# Altium schematic sheet GE910QUAD Modem.SchDoc: GE910 GSM Modem & SIM
size 393 x 281 mm; DocumentNumber: 9; SheetNumber: 9; SheetTotal: 54
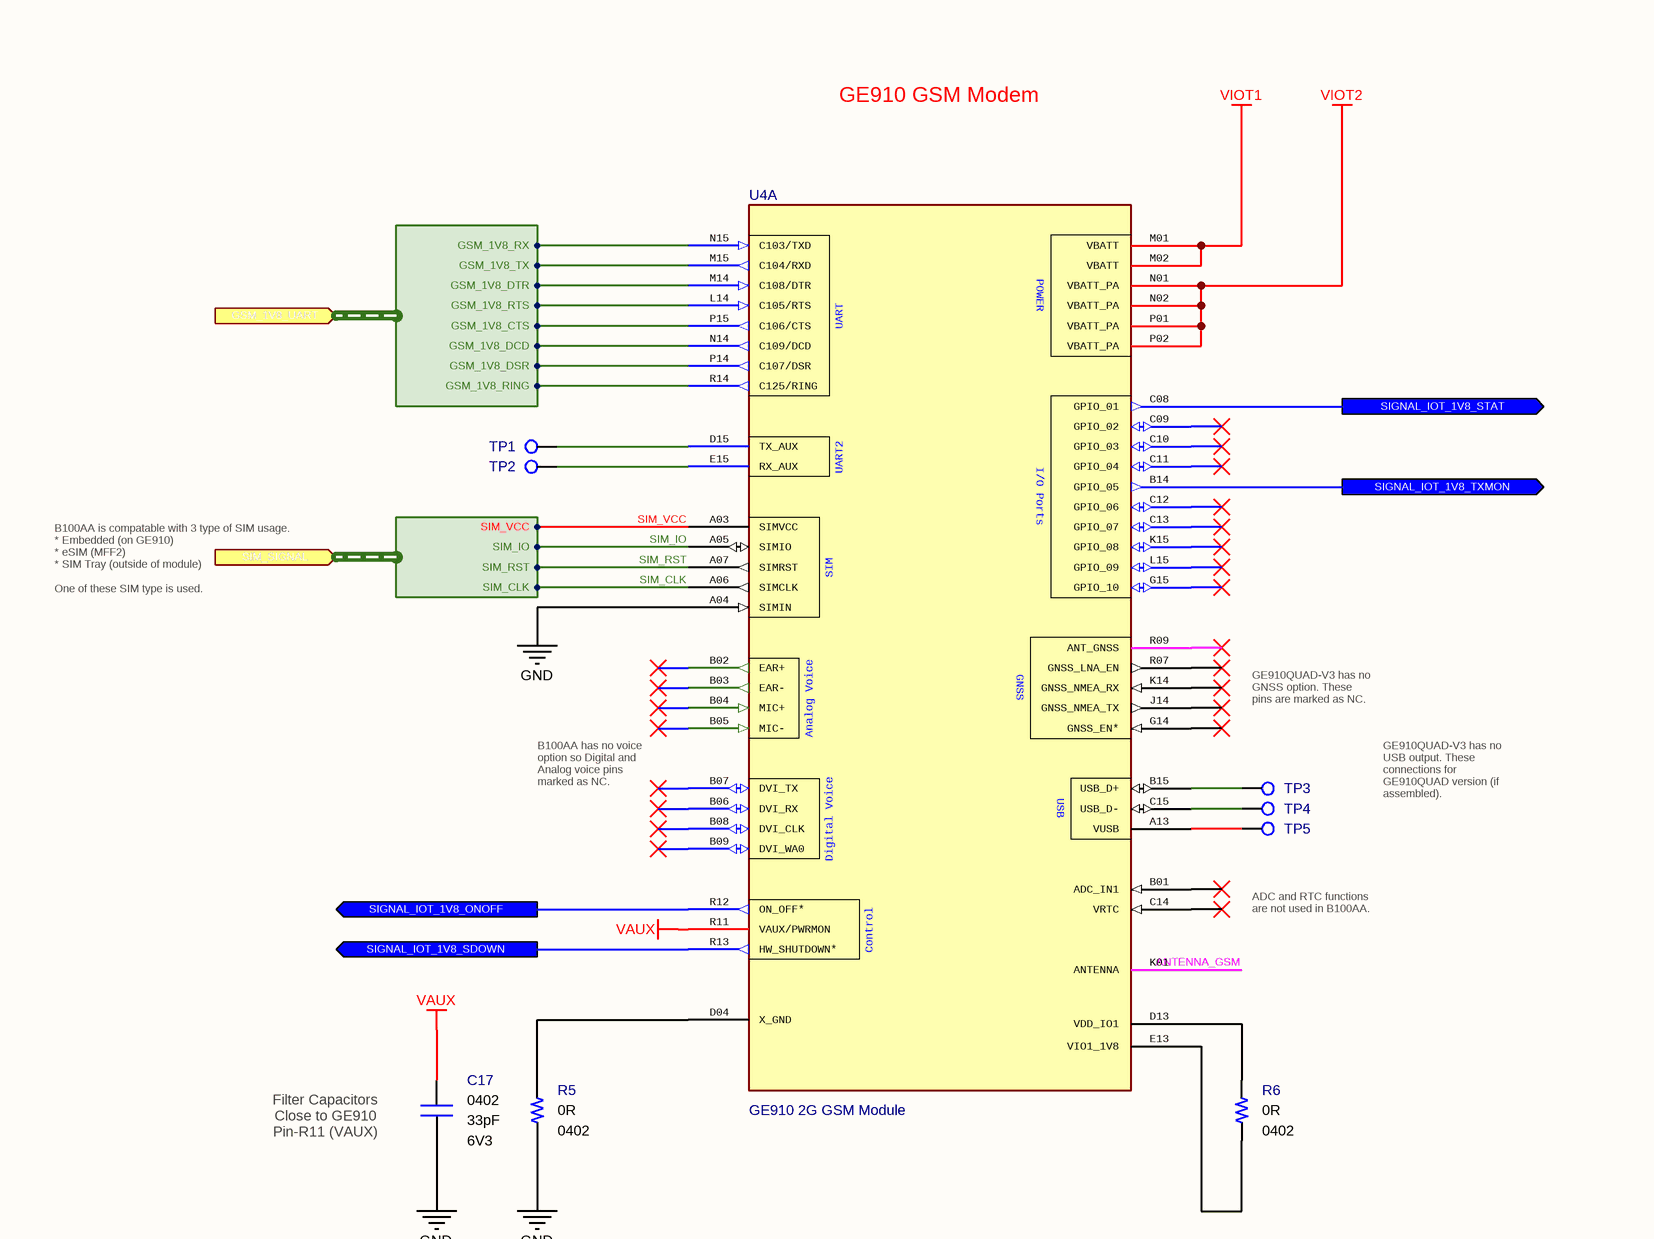
[diagram p0: GE910QUAD Modem.SchDoc, top left]
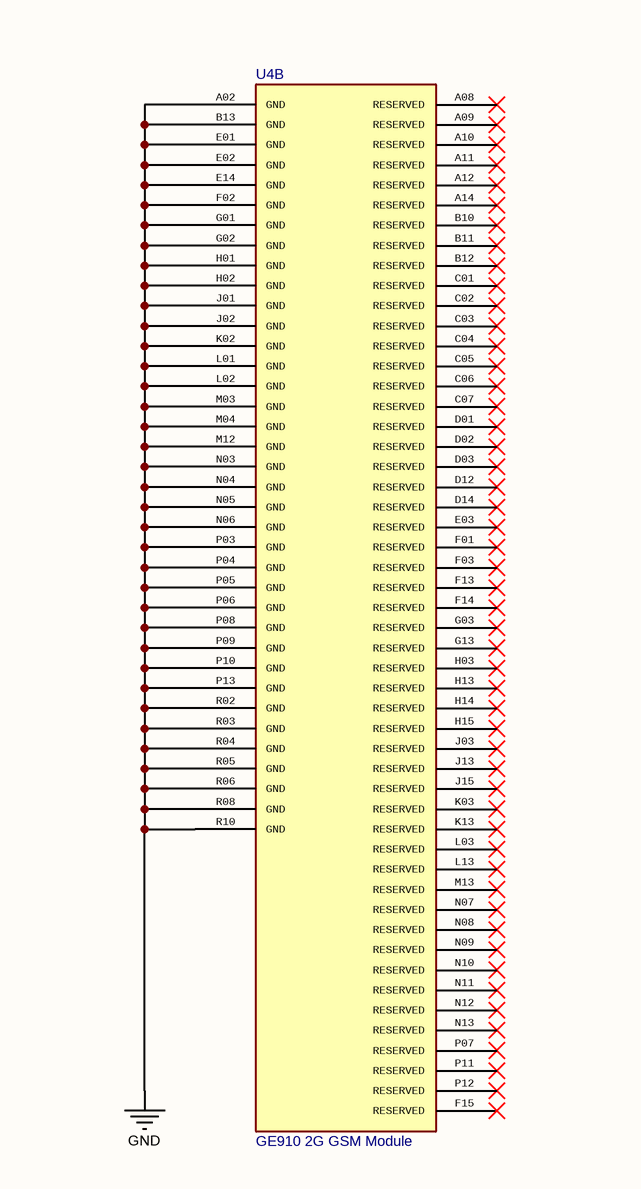
[diagram p1: GE910QUAD Modem.SchDoc, top right]
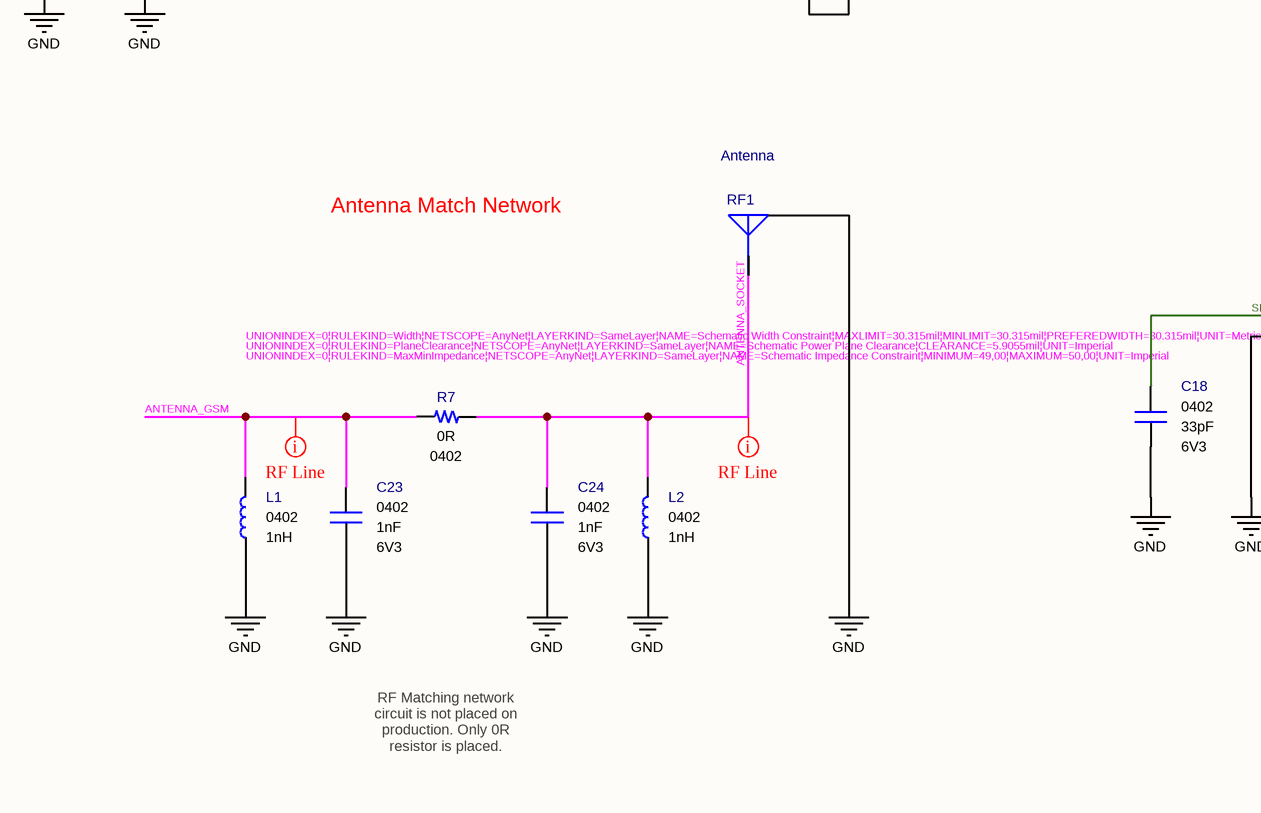
[diagram p2: GE910QUAD Modem.SchDoc, bottom left]
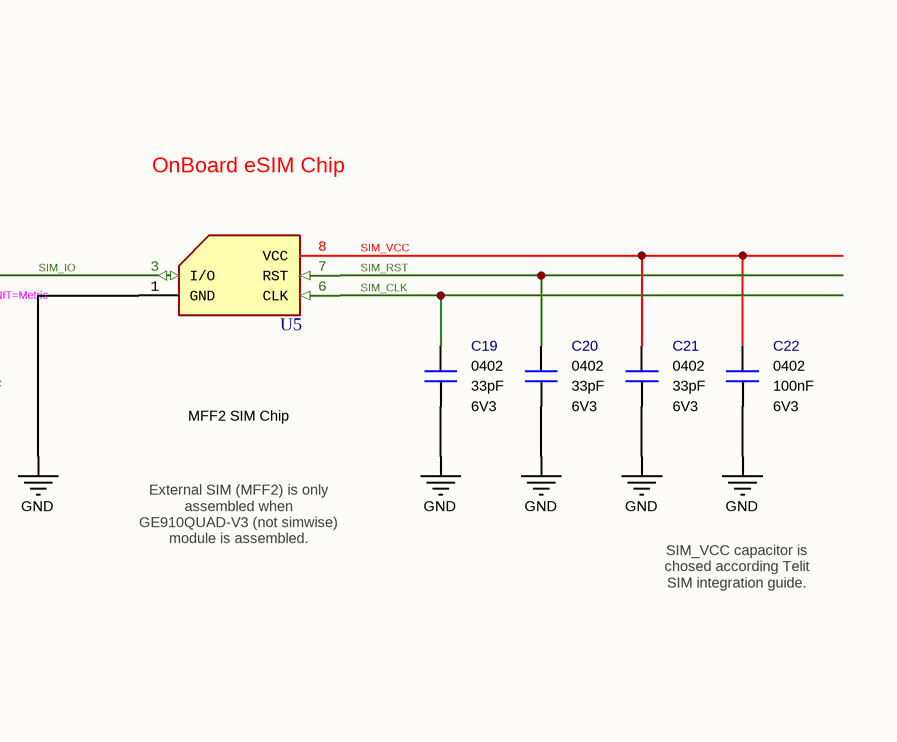
[diagram p3: GE910QUAD Modem.SchDoc, bottom right]

## Parts
C17  value 33pF  Case: 0402  Voltage: 6V3  [CAPACITOR_0402]  (hidden comment: Multilayer Ceramic Capacitor)
C18  value 33pF  Case: 0402  Voltage: 6V3  [CAPACITOR_0402]  (hidden comment: Multilayer Ceramic Capacitor)
C19  value 33pF  Case: 0402  Voltage: 6V3  [CAPACITOR_0402]  (hidden comment: Multilayer Ceramic Capacitor)
C20  value 33pF  Case: 0402  Voltage: 6V3  [CAPACITOR_0402]  (hidden comment: Multilayer Ceramic Capacitor)
C21  value 33pF  Case: 0402  Voltage: 6V3  [CAPACITOR_0402]  (hidden comment: Multilayer Ceramic Capacitor)
C22  value 100nF  Case: 0402  Voltage: 6V3  [CAPACITOR_0402]  (hidden comment: Multilayer Ceramic Capacitor)
C23  value 1nF  Case: 0402  Voltage: 6V3  [CAPACITOR_0402]  (hidden comment: Multilayer Ceramic Capacitor)
C24  value 1nF  Case: 0402  Voltage: 6V3  [CAPACITOR_0402]  (hidden comment: Multilayer Ceramic Capacitor)
L1  value 1nH  Case: 0402  [INDUCTOR_0402]  (hidden comment: Fixed Inductor)
L2  value 1nH  Case: 0402  [INDUCTOR_0402]  (hidden comment: Fixed Inductor)
R5  value 0R  Case: 0402  [RESISTOR_0402]  (hidden comment: Thick Film Resistor)
R6  value 0R  Case: 0402  [RESISTOR_0402]  (hidden comment: Thick Film Resistor)
R7  value 0R  Case: 0402  [RESISTOR_0402]  (hidden comment: Thick Film Resistor)
RF1  Antenna  [Connector_IPEX]
TP1  PCB - Test Point  [Test_Point]  (value not drawn)  (no BOM)
TP2  PCB - Test Point  [Test_Point]  (value not drawn)  (no BOM)
TP3  PCB - Test Point  [Test_Point]  (value not drawn)  (no BOM)
TP4  PCB - Test Point  [Test_Point]  (value not drawn)  (no BOM)
TP5  PCB - Test Point  [Test_Point]  (value not drawn)  (no BOM)
U4  GE910 2G GSM Module  [GE910 2G GSM Modem]  (parts A,B of 2)
U5  MFF2 SIM Chip  [MFF2]

## Ports
GSM_1V8_UART (in, harness GSM_1V8_UART), SIGNAL_IOT_1V8_ONOFF (out), SIGNAL_IOT_1V8_SDOWN (out), SIGNAL_IOT_1V8_STAT (out), SIGNAL_IOT_1V8_TXMON (out), SIM_SIGNAL (in, harness SIM_SIGNAL)

## Harnesses
GSM_1V8_UART: GSM_1V8_RX, GSM_1V8_TX, GSM_1V8_DTR, GSM_1V8_RTS, GSM_1V8_CTS, GSM_1V8_DCD, GSM_1V8_DSR, GSM_1V8_RING
SIM_SIGNAL: SIM_VCC, SIM_IO, SIM_RST, SIM_CLK

## Nets
GND: C17.1 C18.1 C19.1 C20.1 C21.1 C22.1 C23.1 C24.1 L1.1 L2.1 R5.1 RF1.2(GND) U4.A02(GND) U4.A04(SIMIN) U4.B13(GND) U4.E01(GND) U4.E02(GND) U4.E14(GND) U4.F02(GND) U4.G01(GND) U4.G02(GND) U4.H01(GND) U4.H02(GND) U4.J01(GND) U4.J02(GND) U4.K02(GND) U4.L01(GND) U4.L02(GND) U4.M03(GND) U4.M04(GND) U4.M12(GND) U4.N03(GND) U4.N04(GND) U4.N05(GND) U4.N06(GND) U4.P03(GND) U4.P04(GND) U4.P05(GND) U4.P06(GND) U4.P08(GND) U4.P09(GND) U4.P10(GND) U4.P13(GND) U4.R02(GND) U4.R03(GND) U4.R04(GND) U4.R05(GND) U4.R06(GND) U4.R08(GND) U4.R10(GND) U5.1(GND)
VAUX: C17.2 U4.R11(VAUX/PWRMON)
VIOT1: U4.M01(VBATT) U4.M02(VBATT)
VIOT2: U4.N01(VBATT_PA) U4.N02(VBATT_PA) U4.P01(VBATT_PA) U4.P02(VBATT_PA)
ANTENNA_GSM: C23.2 L1.2 R7.2 U4.K01(ANTENNA)
ANTENNA_SOCKET: C24.2 L2.2 R7.1 RF1.1(Signal)
SIGNAL_IOT_1V8_ONOFF: U4.R12(ON_OFF*) ; port SIGNAL_IOT_1V8_ONOFF
SIGNAL_IOT_1V8_SDOWN: U4.R13(HW_SHUTDOWN*) ; port SIGNAL_IOT_1V8_SDOWN
SIGNAL_IOT_1V8_STAT: U4.C08(GPIO_01) ; port SIGNAL_IOT_1V8_STAT
SIGNAL_IOT_1V8_TXMON: U4.B14(GPIO_05) ; port SIGNAL_IOT_1V8_TXMON
SIM_CLK: C19.2 U4.A06(SIMCLK) U5.6(CLK) ; port SIM_SIGNAL.SIM_CLK
SIM_IO: C18.2 U4.A05(SIMIO) U5.3(I/O) ; port SIM_SIGNAL.SIM_IO
SIM_RST: C20.2 U4.A07(SIMRST) U5.7(RST) ; port SIM_SIGNAL.SIM_RST
SIM_VCC: C21.2 C22.2 U4.A03(SIMVCC) U5.8(VCC) ; port SIM_SIGNAL.SIM_VCC
NetR5_2: R5.2 U4.D04(X_GND)
NetR6_1: R6.1 U4.E13(VIO1_1V8)
NetR6_2: R6.2 U4.D13(VDD_IO1)
NetTP1_1: TP1.1 U4.D15(TX_AUX)
NetTP2_1: TP2.1 U4.E15(RX_AUX)
NetTP3_1: TP3.1 U4.B15(USB_D+)
NetTP4_1: TP4.1 U4.C15(USB_D-)
NetTP5_1: TP5.1 U4.A13(VUSB)
NetU4_L14: U4.L14(C105/RTS) ; port GSM_1V8_UART.GSM_1V8_RTS
NetU4_M14: U4.M14(C108/DTR) ; port GSM_1V8_UART.GSM_1V8_DTR
NetU4_M15: U4.M15(C104/RXD) ; port GSM_1V8_UART.GSM_1V8_TX
NetU4_N14: U4.N14(C109/DCD) ; port GSM_1V8_UART.GSM_1V8_DCD
NetU4_N15: U4.N15(C103/TXD) ; port GSM_1V8_UART.GSM_1V8_RX
NetU4_P14: U4.P14(C107/DSR) ; port GSM_1V8_UART.GSM_1V8_DSR
NetU4_P15: U4.P15(C106/CTS) ; port GSM_1V8_UART.GSM_1V8_CTS
NetU4_R14: U4.R14(C125/RING) ; port GSM_1V8_UART.GSM_1V8_RING

Not connected (* = marked no-connect by the designer): U4 A08(RESERVED)* A09(RESERVED)* A10(RESERVED)* A11(RESERVED)* A12(RESERVED)* A14(RESERVED)* B01(ADC_IN1)* B02(EAR+)* B03(EAR-)* B04(MIC+)* B05(MIC-)* B06(DVI_RX)* B07(DVI_TX)* B08(DVI_CLK)* B09(DVI_WA0)* B10(RESERVED)* B11(RESERVED)* B12(RESERVED)* C01(RESERVED)* C02(RESERVED)* C03(RESERVED)* C04(RESERVED)* C05(RESERVED)* C06(RESERVED)* C07(RESERVED)* C09(GPIO_02)* C10(GPIO_03)* C11(GPIO_04)* C12(GPIO_06)* C13(GPIO_07)* C14(VRTC)* D01(RESERVED)* D02(RESERVED)* D03(RESERVED)* D12(RESERVED)* D14(RESERVED)* E03(RESERVED)* F01(RESERVED)* F03(RESERVED)* F13(RESERVED)* F14(RESERVED)* F15(RESERVED)* G03(RESERVED)* G13(RESERVED)* G14(GNSS_EN*)* G15(GPIO_10)* H03(RESERVED)* H13(RESERVED)* H14(RESERVED)* H15(RESERVED)* J03(RESERVED)* J13(RESERVED)* J14(GNSS_NMEA_TX)* J15(RESERVED)* K03(RESERVED)* K13(RESERVED)* K14(GNSS_NMEA_RX)* K15(GPIO_08)* L03(RESERVED)* L13(RESERVED)* L15(GPIO_09)* M13(RESERVED)* N07(RESERVED)* N08(RESERVED)* N09(RESERVED)* N10(RESERVED)* N11(RESERVED)* N12(RESERVED)* N13(RESERVED)* P07(RESERVED)* P11(RESERVED)* P12(RESERVED)* R07(GNSS_LNA_EN)* R09(ANT_GNSS)*; U5 2(NC) 4(NC) 5(NC)

## Layout directives
rule Impedance Constraint [Min = 49.00    Max = 50.00    ]; rule Power Plane Clearance [Clearance = 5.906mil]; rule Width Constraint [Pref Width = 0.77mm    Min Width = 0.77mm    Max Width = 0.77mm]: ANTENNA_GSM, ANTENNA_SOCKET

## Notes on the sheet
- GE910 GSM Modem
- B100AA is compatable with 3 type of SIM usage.
  * Embedded (on GE910)
  * eSIM (MFF2)
  * SIM Tray (outside of module)
  One of these SIM type is used.
- GE910QUAD-V3 has no GNSS option. These pins are marked as NC.
- B100AA has no voice option so Digital and Analog voice pins marked as NC.
- GE910QUAD-V3 has no USB output. These connections for GE910QUAD version (if assembled).
- ADC and RTC functions are not used in B100AA.
- (near C17) Filter Capacitors
  Close to GE910
  Pin-R11 (VAUX)
- Antenna Match Network
- (near U5) OnBoard eSIM Chip
- External SIM (MFF2) is only assembled when GE910QUAD-V3 (not simwise) module is assembled.
- SIM_VCC capacitor is chosed according Telit SIM integration guide.
- RF Matching network circuit is not placed on production. Only 0R resistor is placed.
- © 2021 All rights reserved.
  This document may not, in whole or in part, be copied, photocopied, reproduced, translated or converted to any electronic or machine readable from without prior written permission of Mehmet Günce Akkoyun.
  Engineer contact : akkoyun@me.com
- Property of
- Engineer :
- Date :
- Size :
- A3
- Time :
- Project :
- Page :
- /
- Customer :
- Product ID :
- Module ID :
- Version :
- File :
- Revision :
- (in symbol IC - Telit GE910QUAD, part A) POWER; UART; UART2; I/O Ports; SIM; GNSS; Analog Voice; USB; Digital Voice; Control

## Library data of the parts
C17-C21 = Capacitor - 33pF [0402-6V3]: Capacitor - 33pF [0402] (Ceramic); Manufacturer Name: Kemet; Manufacturer Part Number: C0402C330J9RACAUTO; Dielectric: X7R; Tolerance: 10%; Height: 0.5mm; Maximum Operating Temperature: +125; Minimum Operating Temperature: -55; ROHS: Yes; ComponentLink1Description: DataSheet; ComponentLink1URL: https://api.kemet.com/component-edge/download/datasheet/C0402C330J9RACAUTO.pdf; ComponentLink2Description: Mouser; ComponentLink2URL: https://www.mouser.com/Search/Refine.aspx?Keyword=80-C0402C330J9RAUTO; Supplier 1: Mouser; Supplier Part Number 1: 80-C0402C330J9RAUTO; Mouser Part Number: 80-C0402C330J9RAUTO
C22 = Capacitor - 100nF [0402-6V3]: Capacitor - 100nF [0402-6V3] (Ceramic); Manufacturer Name: AVX; Manufacturer Part Number: 04026D104KAT4A; Dielectric: X5R; Tolerance: %10; Height: 0.25mm; ComponentLink1Description: Mouser; ComponentLink1URL: https://www.mouser.com.tr/ProductDetail/AVX/04026D104KAT4A?qs=sGAEpiMZZMs0AnBnWHyRQPg4iYkCw7IMED%2F4kpqgf7w%3D; ComponentLink2Description: DataSheet; ComponentLink2URL: https://www.mouser.com.tr/datasheet/2/40/cx5r-776519.pdf; ROHS: Yes; Maximum Operating Temperature: +85; Minimum Operating Temperature: -55; Supplier 1: Avnet; Supplier Part Number 1: 04026D104KAT4A; Mouser Part Number: 581-04026D104KAT4A
C23 C24 = Capacitor - 1nF [0402-6V3]: Capacitor - 1nF [0402] (Ceramic); Manufacturer Name: AVX; Manufacturer Part Number: 04026C102MAT2A; Dielectric: X7R; Tolerance: 20%; Height: 0.25mm; Mouser Price/Stock: 0.074; Maximum Operating Temperature: +125; Minimum Operating Temperature: -55; ROHS: Yes; Weight: 0.65mg; ComponentLink1Description: DataSheet; ComponentLink1URL: https://www.mouser.com.tr/datasheet/2/40/X7RDielectric-777024.pdf; Supplier 1: Mouser; Supplier Part Number 1: 581-04026C102MAT2A; Mouser Part Number: 581-04026C102MAT2A; ComponentLink2Description: Mouser; ComponentLink2URL: https://www.mouser.com.tr/ProductDetail/AVX/04026C102MAT2A/?qs=%2Fha2pyFaduih52wBA08yQb8Fl0MEN8ljDrRW0UuYpjAzFvrGZxsBOQ%3D%3D
L1 L2 = Inductor - 1nH [0402]: Manufacturer Name: Murata Electronics; Manufacturer Part Number: LQG15HN1N0S02D; Tolerance: 0.3 nH; Height: 0.35mm; ComponentLink1Description: DataSheet; ComponentLink1URL: https://www.mouser.com.tr/datasheet/2/281/JELF243B-0009-1699631.pdf; ComponentLink2Description: Mouser; ComponentLink2URL: https://www.mouser.com.tr/ProductDetail/Murata-Electronics/LQG15HN1N0S02D?qs=sGAEpiMZZMsg%252By3WlYCkUySk0uOsB1dTfJeMbA4C8Pk%3D; Supplier 1: Future Electronics; Supplier 2: Future Electronics; Supplier 3: Mouser; Supplier 4: Arrow; Supplier 5: Digi-Key; Supplier Part Number 1: LQG15HN1N0S02D-CUTT; Supplier Part Number 2: LQG15HN1N0S02D-REEL; Supplier Part Number 3: 81-LQG15HN1N0S02D; Supplier Part Number 4: LQG15HN1N0S02D; Supplier Part Number 5: 490-1073-1-ND; Mouser Part Number: 81-LQG15HN1N0S02D
R5-R7 = Resistor - 0R: Thick Film Resistors - SMD 1/16 W 0 Ohms; Manufacturer Name: Vishay; Manufacturer Part Number: CRCW04020000Z0ED; Height: 0.4mm; ComponentLink1Description: DataSheet; ComponentLink1URL: https://www.mouser.com.tr/datasheet/2/427/dcrcwe3-1762152.pdf; ComponentLink2Description: Mouser; ComponentLink2URL: https://www.mouser.com.tr/ProductDetail/Vishay-Dale/CRCW04020000Z0ED?qs=sGAEpiMZZMu61qfTUdNhG2DpbjADlD3GG34cJb50zyg%3D; Supplier 1: Mouser; Supplier 2: Digi-Key; Supplier Part Number 1: 71-CRCW0402-0-E3; Supplier Part Number 2: 541-0.0JCT-ND; Mouser Part Number: 71-CRCW0402-0-E3
RF1 = Connector - MHF: MHF Antenna Socket; ROHS: Yes; Supplier 1: Mouser; Supplier 2: Arrow; Supplier Part Number 1: 200-RSP-122811-01; Supplier Part Number 2: RSP-122811-01; Case: SMD
TP1-TP5 = PCB - Test Point: Test Point
U4 = IC - Telit GE910QUAD: Telit GE910 GPRS/UMTS Module; ComponentLink1Description: Product Page; ComponentLink1URL: https://www.telit.com/product-series/ge910/; Manufacturer Name: Telit; Manufacturer Part Number: GE910QUAD; Case: BGA
U5 = IC - MFF2: SIM Chip MFF2